# Altium project MCP2200_board.PrjPcb
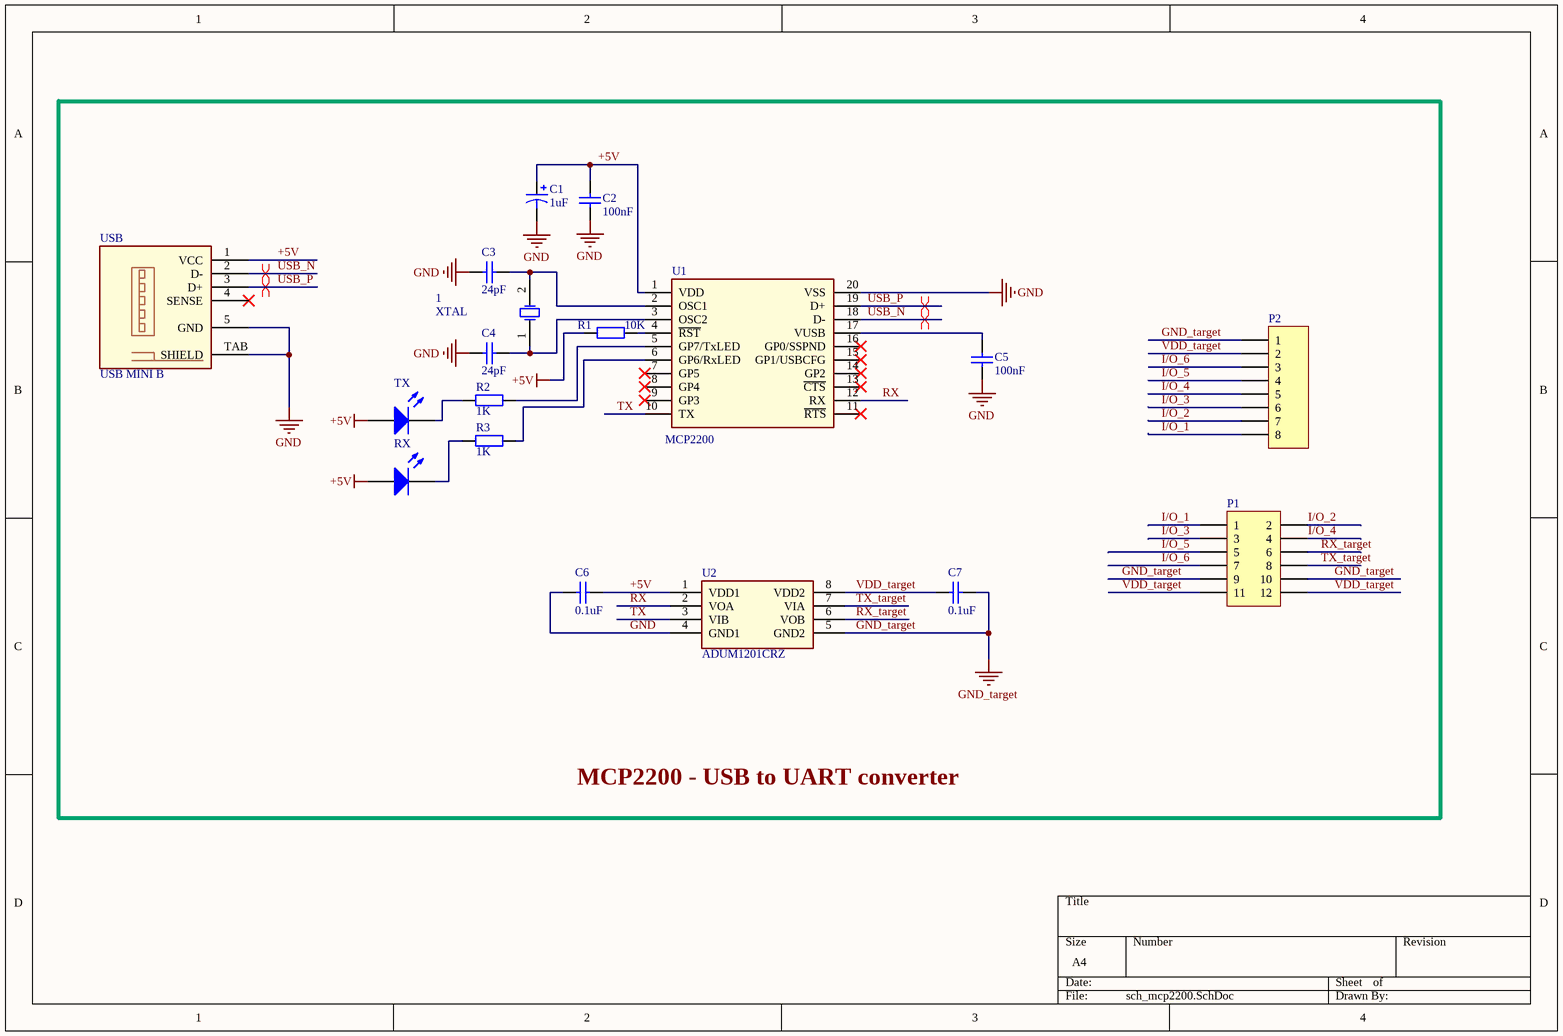
[diagram p0: sch_mcp2200.SchDoc]
1 sheet, 18 parts. Net scope: global (net labels, ports and power ports of the same name join across sheets).
Board file: pcb_mcp2200.PcbDoc

## Sheet sch_mcp2200.SchDoc
size A4

### Parts
1  XTAL  [Cuart_SMD_5032]
C1  value 1uF  [case A]  (hidden comment: Cap Pol1)
C2  value 100nF  [0603(C)]  (hidden comment: Cap)
C3  value 24pF  [0603(C)]  (hidden comment: Cap)
C4  value 24pF  [0603(C)]  (hidden comment: Cap)
C5  value 100nF  [0603(C)]  (hidden comment: Cap)
C6  value 0.1uF  [0603(C)]  (hidden comment: Cap)
C7  value 0.1uF  [0603(C)]  (hidden comment: Cap)
P1  Header 6X2H  [Header 2x6_right angle]  (value not drawn)
P2  Header 8H  [Header_1x8_right angle]  (value not drawn)
R1  value 10K  [RezistorSMD (1608)]  (hidden comment: Res2)
R2  value 1K  [RezistorSMD (1608)]  (hidden comment: Res2)
R3  value 1K  [RezistorSMD (1608)]  (hidden comment: Res2)
RX  LED3  [led smd verde]  (value not drawn)
TX  LED3  [led smd verde]  (value not drawn)
U1  MCP2200  [SOIC_20]
U2  ADUM1201CRZ  [SOIC 8 pini]
USB  USB MINI B  [USB MINI B]

### Blocks framed on the sheet
MCP2200 - USB to UART converter: 1 C1-C7 P1 P2 R1-R3 RX TX U1 U2 USB

### Nets
+5V: C1.1 C2.2 C6.2 R1.1 RX.1(A) TX.1(A) U1.1(VDD) U2.1(VDD1) USB.1(VCC)
GND: C1.2 C2.1 C3.2 C4.2 C5.1 C6.1 U1.20(VSS) U2.4(GND1) USB.5(GND) USB.TAB(SHIELD)
GND_target: C7.2 P1.9 P1.10 P2.1 U2.5(GND2)
I/O_1: P1.1 P2.8
I/O_2: P1.2 P2.7
I/O_3: P1.3 P2.6
I/O_4: P1.4 P2.5
I/O_5: P1.5 P2.4
I/O_6: P1.7 P2.3
RX: U1.12(RX) U2.2(VOA)
RX_target: P1.6 U2.6(VOB)
TX: U1.10(TX) U2.3(VIB)
TX_target: P1.8 U2.7(VIA)
USB_N: U1.18(D-) USB.2(D-)
USB_P: U1.19(D+) USB.3(D+)
VDD_target: C7.1 P1.11 P1.12 P2.2 U2.8(VDD2)
Net1_1: 1.1(OSC1) C4.1 U1.3(OSC2)
Net1_2: 1.2(OSC2) C3.1 U1.2(OSC1)
NetC5_2: C5.2 U1.17(VUSB)
NetR1_2: R1.2 U1.4(~{RST})
NetR2_1: R2.1 TX.2(K)
NetR2_2: R2.2 U1.5(GP7/TxLED)
NetR3_1: R3.1 RX.2(K)
NetR3_2: R3.2 U1.6(GP6/RxLED)

Not connected (* = marked no-connect by the designer): U1 7(GP5)* 8(GP4)* 9(GP3)* 11(~{RTS})* 13(~{CTS})* 14(GP2)* 15(GP1/USBCFG)* 16(GP0/SSPND)*; USB 4(SENSE)*

### Layout directives
differential pair: USB_N, USB_P

### Library data of the parts
1 = XTAL: Crystal Oscillator; Published: 8-Jun-2000; LatestRevisionDate: 17-Jul-2002; LatestRevisionNote: Re-released for DXP Platform.; PackageReference: R38; Publisher: Altium Limited; PackageDescription: Crystal, Thru-Hole; 2 Leads; Body 3.1 x 8.2 mm (Dia.xH)
C1 = Cap Pol1: Polarized Capacitor (Radial); Published: 8-Jun-2000; LatestRevisionDate: 17-Jul-2002; LatestRevisionNote: Re-released for DXP Platform.; PackageReference: RB7.6-15; Publisher: Altium Limited; PackageDescription: Polarized Capacitor (Radial); 2 Leads
C2-C7 = Cap: Capacitor; Published: 8-Jun-2000; LatestRevisionDate: 17-Jul-2002; LatestRevisionNote: Re-released for DXP Platform.; PackageReference: RAD-0.3; Publisher: Altium Limited; PackageDescription: Radial Cap, Thru-Hole; 2 Leads; 0.3 in Pin Spacing
P1 = Header 6X2H: Header, 6-Pin, Dual row, Right Angle; LatestRevisionDate: 17-Jul-2002; LatestRevisionNote: Re-released for DXP Platform.; Publisher: Altium Limited
P2 = Header 8H: Header, 8-Pin, Right Angle; LatestRevisionDate: 17-Jul-2002; LatestRevisionNote: Re-released for DXP Platform.; Publisher: Altium Limited
R1-R3 = Res2: Resistor; Published: 8-Jun-2000; LatestRevisionDate: 17-Jul-2002; LatestRevisionNote: Re-released for DXP Platform.; PackageReference: AXIAL-0.4; Publisher: Altium Limited; PackageDescription: Axial Device, Thru-Hole; 2 Leads; 0.4 in Pin Spacing
RX TX = LED3: Typical BLUE SiC LED; Published: 8-Jun-2000; LatestRevisionDate: 17-Dec-2003; LatestRevisionNote: PCB Footprint replaced.; DatasheetVersion: 16-Apr-2002; PackageVersion: 16-Apr-2002; PackageReference: 3.5X2.8X1.9; Publisher: Altium Limited; PackageDescription: SM LED; 2 C-Bend Leads; Body 3.5 x 2.8 x 1.9 mm, inc leads (LxWxH typ)
U1 = MCP2200: USB 2.0 to UART Protocol Converter with GPIO